# EAGLE design main (EAGLE 6.4)
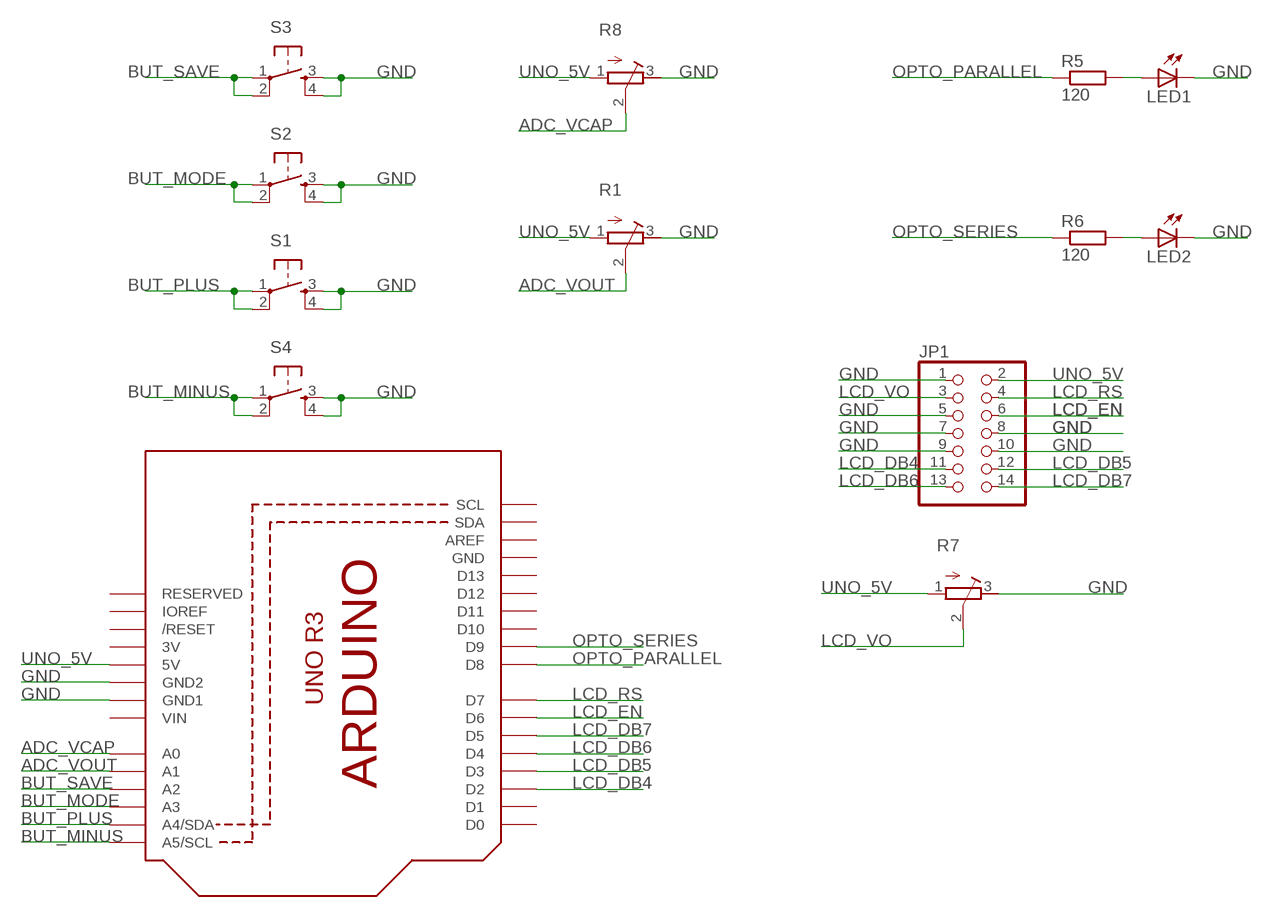
[diagram p0: schematic, sheet 1]

## Parts
JP1  PINHD-2X7  [2X07]
LED1  LED5MM  [LED5MM]
LED2  LED5MM  [LED5MM]
R1  R-TRIMM3339P  [RTRIM3339P]
R5  120  R-EU_0204/5  [0204/5]
R6  120  R-EU_0204/5  [0204/5]
R7  R-TRIMM3339P  [RTRIM3339P]
R8  R-TRIMM3339P  [RTRIM3339P]
S1  TAC_SWITCHPTH  [TACTILE-PTH]
S2  TAC_SWITCHPTH  [TACTILE-PTH]
S3  TAC_SWITCHPTH  [TACTILE-PTH]
S4  TAC_SWITCHPTH  [TACTILE-PTH]
U1  ARDUINOR3-BPLACE  [ARDUINOR3-BPLACE]

## Nets
ADC_VCAP: R8.2(S) U1.A0
ADC_VOUT: R1.2(S) U1.A1
BUT_MINUS: S4.1 S4.2 U1.A5(A5/SCL)
BUT_MODE: S2.1 S2.2 U1.A3
BUT_PLUS: S1.1 S1.2 U1.A4(A4/SDA)
BUT_SAVE: S3.1 S3.2 U1.A2
GND: JP1.1 JP1.5 JP1.7 JP1.8 JP1.9 JP1.10 LED1.K(C) LED2.K(C) R1.3(A) R7.3(A) R8.3(A) S1.3 S1.4 S2.3 S2.4 S3.3 S3.4 S4.3 S4.4 U1.GND1 U1.GND2
LCD_DB4: JP1.11 U1.D2
LCD_DB5: JP1.12 U1.D3
LCD_DB6: JP1.13 U1.D4
LCD_DB7: JP1.14 U1.D5
LCD_EN: JP1.6 U1.D6
LCD_RS: JP1.4 U1.D7
LCD_VO: JP1.3 R7.2(S)
N$3: LED1.A R5.2
N$4: LED2.A R6.2
OPTO_PARALLEL: R5.1 U1.D8
OPTO_SERIES: R6.1 U1.D9
UNO_5V: JP1.2 R1.1(E) R7.1(E) R8.1(E) U1.5V
Unconnected: U1.AREF U1.D0 U1.D1 U1.D10 U1.D11 U1.D12 U1.D13 U1.IOREF U1.RESERVED U1.RESET(/RESET) U1.SCL U1.SDA

## Power pins joined to a net without a drawn wire
3V: U1.3V
GND: U1.GND
VIN: U1.VIN

## Library data of the parts
JP1 = pinhead:PINHD-2X7: PIN HEADER
LED1 LED2 = adafruit:LED: LED OSRAM: - CHIPLED LG R971, LG N971, LY N971, LG Q971, LY Q971, LO R971, LY R971 LH N974, LH R974 LS Q976, LO Q976, LY Q976 LO Q996 - Hyper CHIPLED LW Q18S LB Q993, LB Q99A, LB R99A - SideLED LS A670, LO A670, LY A670, LG A670, LP A670 LB A673, LV A673, LT A673, LW A673 LH A674 LY A675 LS A676, LA A676, LO A676, LY A676, LW A676 LS A679, LY A679, LG A679 - Hyper Micro SIDELED® LS Y876, LA Y876, LO Y876, LY Y876 LT Y87S - SmartLED LW L88C, LW L88S LB L89C, LB L89S, LG L890 LS L89K, LO L89K, LY L89K LS L896, LA L896, LO L896, LY L896 - TOPLED LS T670, LO T670, LY T670, LG T670, LP T670 LSG T670, LSP T670, LSY T670, LOP T670, LYG T670 LG T671, LOG T671, LSG T671 LB T673, LV T673, LT T673, LW T673 LH T674 LS T676, LA T676, LO T676, LY T676, LB T676, LH T676, LSB T676, LW T676 LB T67C, LV T67C, LT T67C, LS T67K, LO T67K, LY T67K, LW E67C LS E67B, LA E67B, LO E67B, LY E67B, LB E67C, LV E67C, LT E67C LW T67C LS T679, LY T679, LG T679 LS T770, LO T770, LY T770, LG T770, LP T770 LB T773, LV T773, LT T773, LW T773 LH T774 LS E675, LA E675, LY E675, LS T675 LS T776, LA T776, LO T776, LY T776, LB T776 LHGB T686 LT T68C, LB T68C - Hyper Mini TOPLED® LB M676 - Mini TOPLED Santana® LG M470 LS M47K, LO M47K, LY M47K Source: http://www.osram.convergy.de/
R1 R7 R8 = resistor:R-TRIMM: Trimm resistor
R5 R6 = rcl:R-EU_: RESISTOR, European symbol
S1-S4 = SparkFun-Electromechanical:TAC_SWITCH: Momentary Switch Button commonly used for reset or general input. Spark Fun Electronics SKU : COM-00097 SMT- SWCH-08247
U1 = adafruit:ARDUINOR3: This is a new object for the new Arduino R3 - with extra pins that you may want to use (such as IOref, and duplicated A4/A5

## Board
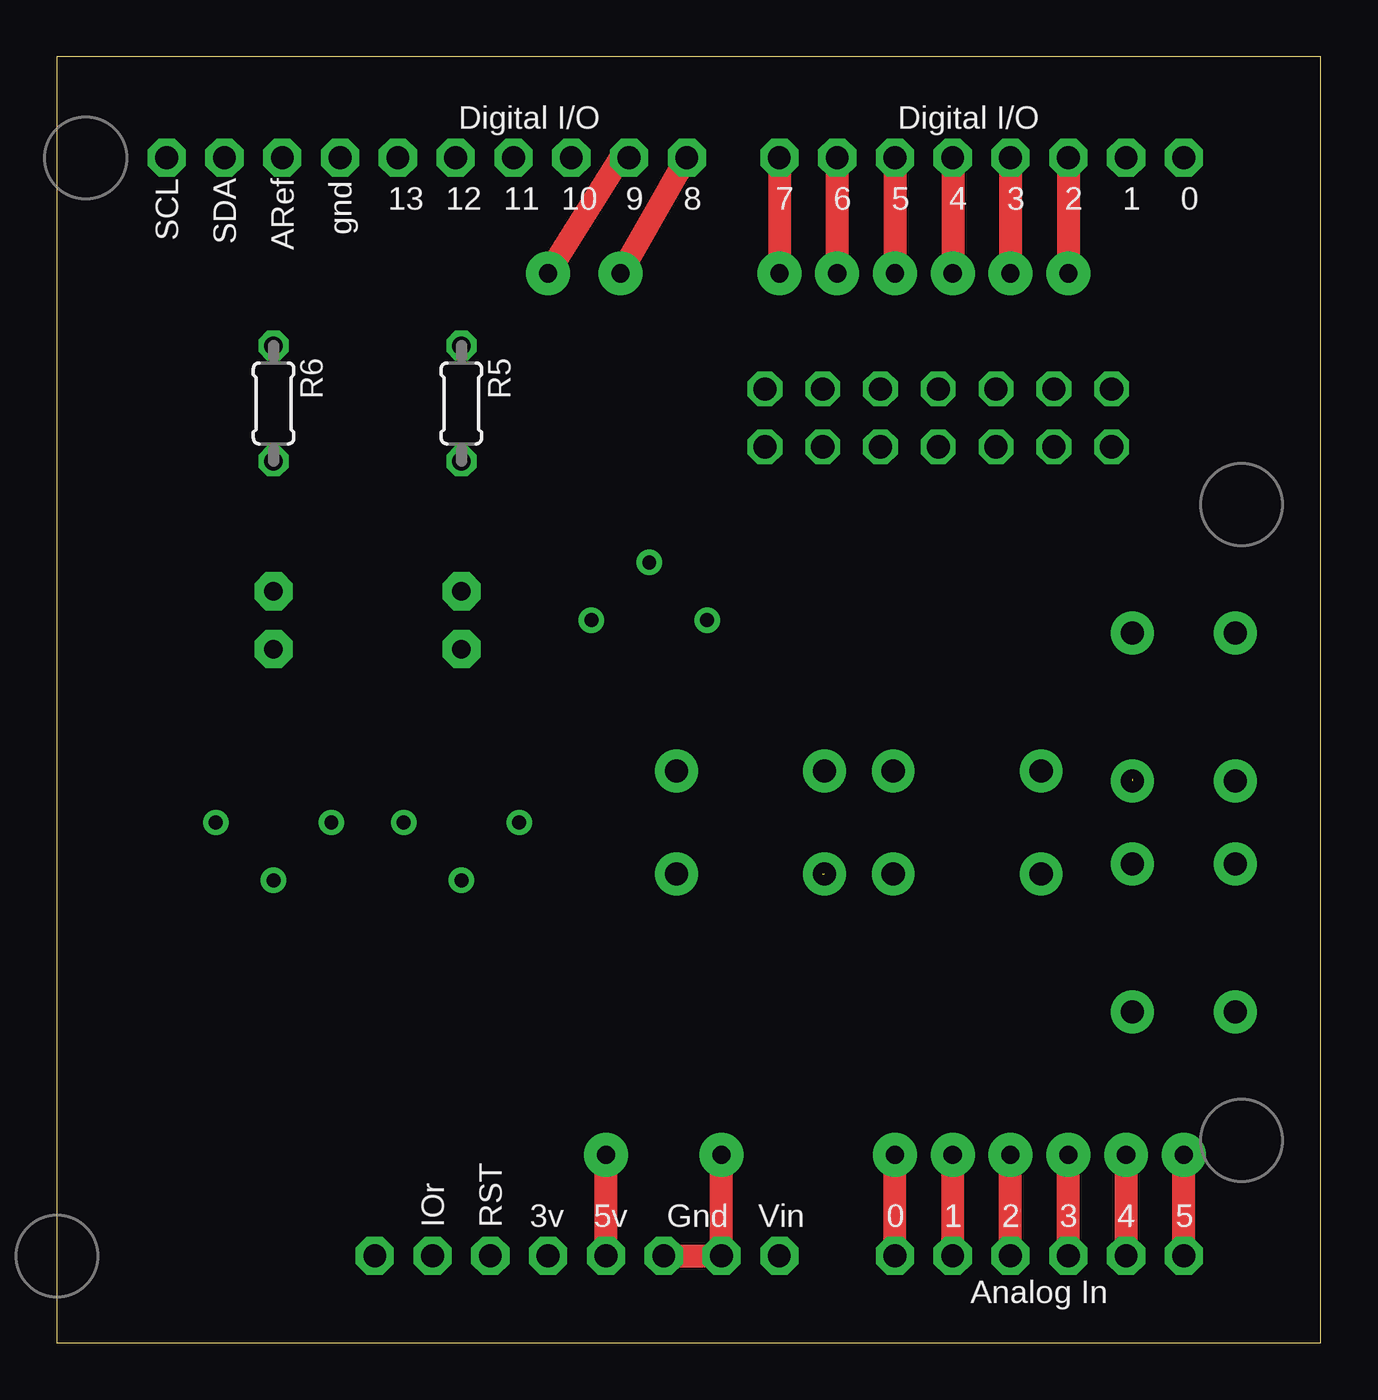
[diagram p1: board, top side]
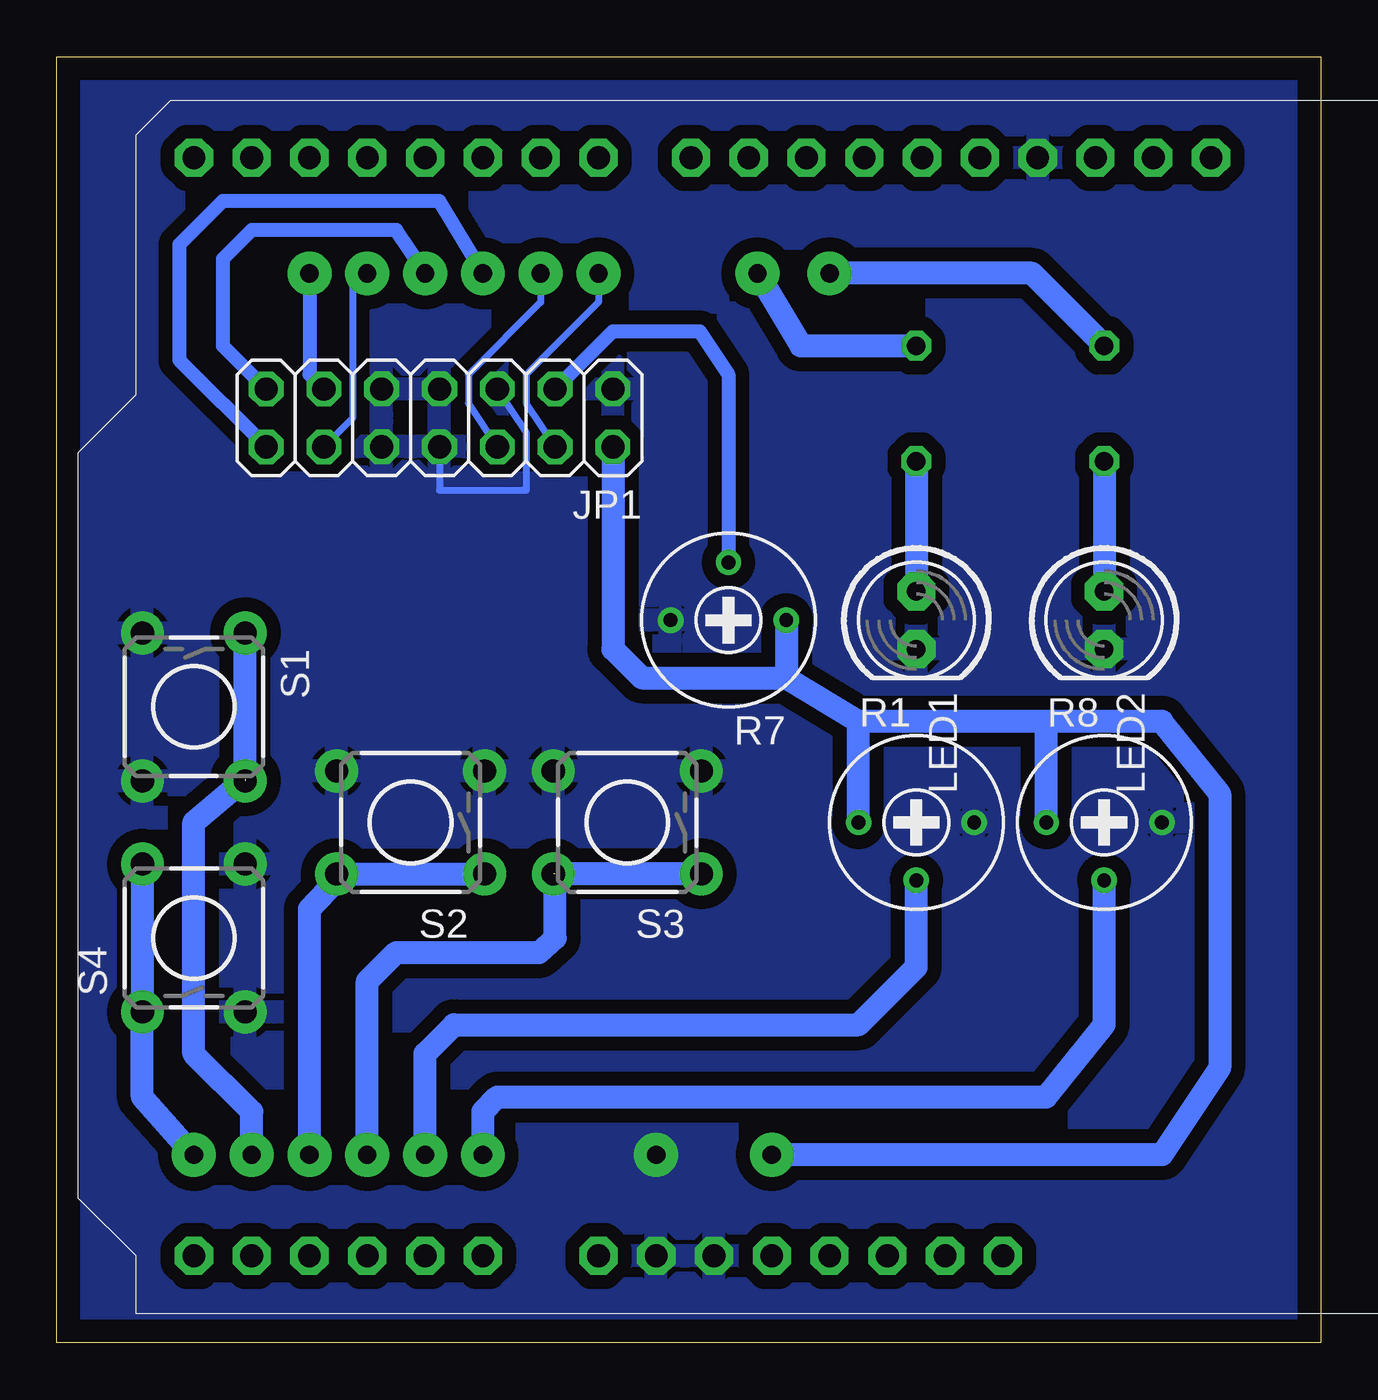
[diagram p2: board, bottom side, seen from below]

Size 55.55 x 56.51 mm. Coordinates in mm from the lower left corner, seen from the top.
Outline: 0,0 55.55,0 55.55,56.51 0,56.51 0,0
Copper layers (1*16): Top 0.035mm / dielectric 1.5mm / Bottom 0.035mm
Design rules "default": minimum track width 10mil, minimum drill 24mil, track to track 8mil, track to pad 8mil, pad to pad 8mil, via to via 8mil, smd to smd 8mil, copper to edge 40mil, drill to drill 8mil, minimum pad ring 10mil, minimum via ring 8mil, stop-mask expansion 4mil, vias tented up to drill 0mil, thermal gap 10mil

### Footprints (pad centres in the part's own frame; a part is rotated, then mirrored left to right if it is on the bottom)
2X07 = drill 1.016 octagon: 1 -7.62,-1.27; 2 -7.62,1.27; 3 -5.08,-1.27; 4 -5.08,1.27; 5 -2.54,-1.27; 6 -2.54,1.27; 7 0,-1.27; 8 0,1.27; 9 2.54,-1.27; 10 2.54,1.27; 11 5.08,-1.27; 12 5.08,1.27; 13 7.62,-1.27; 14 7.62,1.27
LED5MM = drill 0.813 pad 1.676 octagon: A -1.27,0; K 1.27,0
RTRIM3339P = drill 0.61: 1 -2.54,0; 2 0,-2.54; 3 2.54,0
0204/5 = drill 0.813 octagon: 1 -2.54,0; 2 2.54,0
TACTILE-PTH = drill 1.016 pad 1.88: 1 -3.251,2.261; 2 3.251,2.261; 3 -3.251,-2.261; 4 3.251,-2.261
ARDUINOR3-BPLACE = drill 1 pad 1.676 octagon: 3V 35.56,2.54; 5V 38.1,2.54; A0 50.8,2.54; A1 53.34,2.54; A2 55.88,2.54; A3 58.42,2.54; A4 60.96,2.54; A5 63.5,2.54; AREF 23.876,50.8; D0 63.5,50.8; D1 60.96,50.8; D2 58.42,50.8; D3 55.88,50.8; D4 53.34,50.8; D5 50.8,50.8; D6 48.26,50.8; D7 45.72,50.8; D8 41.656,50.8; D9 39.116,50.8; D10 36.576,50.8; D11 34.036,50.8; D12 31.496,50.8; D13 28.956,50.8; GND 26.416,50.8; GND1 43.18,2.54; GND2 40.64,2.54; IOREF 30.48,2.54; RESERVED 27.94,2.54; RESET 33.02,2.54; SCL 18.796,50.8; SDA 21.336,50.8; VIN 45.72,2.54

### Placement (x,y rotation side)
JP1  38.73,40.64 180 bottom
LED1  17.78,31.75 270 bottom
LED2  9.53,31.75 270 bottom
R1  17.78,22.86 0 bottom
R5  17.78,41.27 270 top
R6  9.53,41.27 270 top
R7  26.04,31.75 180 bottom
R8  9.53,22.86 0 bottom
S1  49.53,27.94 270 bottom
S2  40.01,22.86 180 bottom
S3  30.48,22.86 180 bottom
S4  49.53,17.78 90 bottom
U1  -13.97,1.27 0 top

### Tracks (layer width: path | path; a pad name or v marks a point on that pad's centre or on a via)
ADC_VCAP  (via drill 0.8 pad 1.93)
  Top 1.016: U1.A0 v36.83,8.26
  Bottom 1.016: v36.83,8.26 36.83,10.16 36.2,10.79 12.06,10.79 9.53,13.97 R8.2
ADC_VOUT  (via drill 0.8 pad 1.93)
  Top 1.016: U1.A1 v39.37,8.26
  Bottom 1.016: v39.37,8.26 39.37,12.7 38.1,13.97 20.32,13.97 17.78,16.51 R1.2
BUT_MINUS  (via drill 0.8 pad 1.93)
  Top 1.016: U1.A5 v49.53,8.26
  Bottom 1.016: S4.2 S4.1 51.79,10.79 v49.53,8.26
BUT_MODE  (via drill 0.8 pad 1.93)
  Top 1.016: U1.A3 v44.45,8.26
  Bottom 1.016: S2.1 S2.2 43.26,20.32 44.45,19.05 v44.45,8.26
BUT_PLUS  (via drill 0.8 pad 1.93)  (1 unrouted)
  Top 1.016: U1.A4 v46.99,8.26
  Bottom 1.016: v46.99,8.26 46.99,10.16 49.53,12.7 49.53,22.86 47.27,24.77 S1.1
BUT_SAVE  (via drill 0.8 pad 1.93)  (1 unrouted)
  Top 1.016: U1.A2 v41.91,8.26
  Bottom 1.016: v41.91,8.26 41.91,15.88 40.64,17.14 34.37,17.14 33.66,17.78 33.66,20.6 | S3.1 S3.2
GND  (via drill 0.8 pad 1.93)
  Top 1.016: U1.GND2 U1.GND1 v29.21,8.26
  Bottom 0.305: JP1.5 34.92,40.01 34.92,37.47 38.73,37.47 JP1.8
  pour Bottom (isolate 0.61): -0.64,56.52 55.88,56.52 56.52,0 0,0
LCD_DB4  (via drill 0.8 pad 1.93)
  Top 1.016: U1.D2 v44.45,46.99
  Bottom 0.61: v44.45,46.99 44.45,42.55 JP1.11
LCD_DB5  (via drill 0.8 pad 1.93)
  Top 1.016: U1.D3 v41.91,46.99
  Bottom 0.305: v41.91,46.99 42.55,46.35 42.55,40.64 JP1.12
LCD_DB6  (via drill 0.8 pad 1.93)
  Top 1.016: U1.D4 v39.37,46.99
  Bottom 0.61: v39.37,46.99 40.64,48.9 46.99,48.9 48.26,47.62 48.26,43.81 JP1.13
LCD_DB7  (via drill 0.8 pad 1.93)
  Top 1.016: U1.D5 v36.83,46.99
  Bottom 0.61: v36.83,46.99 38.73,50.16 48.26,50.16 50.16,48.26 50.16,43.18 JP1.14
LCD_EN  (via drill 0.8 pad 1.93)
  Top 1.016: U1.D6 v34.29,46.99
  Bottom 0.305: v34.29,46.99 34.29,45.72 37.47,42.55 37.47,41.27 JP1.6
LCD_RS  (via drill 0.8 pad 1.93)
  Top 1.016: U1.D7 v31.75,46.99
  Bottom 0.305: v31.75,46.99 31.75,45.72 34.92,42.55 34.92,41.27 JP1.4
LCD_VO
  Bottom 0.61: JP1.3 31.11,44.45 27.3,44.45 26.04,42.55 R7.2
N$3
  Bottom 1.016: R5.2 LED1.A
N$4
  Bottom 1.016: R6.2 LED2.A
OPTO_PARALLEL  (via drill 0.8 pad 1.93)
  Top 1.016: U1.D8 27.3,51.44 v24.77,46.99
  Bottom 1.016: v24.77,46.99 22.86,43.81 R5.1
OPTO_SERIES  (via drill 0.8 pad 1.93)
  Top 1.016: U1.D9 24.77,52.07 v21.59,46.99
  Bottom 1.016: R6.1 12.7,46.99 v21.59,46.99
UNO_5V  (via drill 0.8 pad 1.93)
  Top 1.016: U1.5V v24.13,8.26
  Bottom 1.016: R7.1 23.5,29.21 | 23.5,29.21 20.32,27.3 | JP1.2 31.11,30.48 29.84,29.21 23.5,29.21 | 12.06,27.3 6.99,27.3 4.45,24.13 4.45,12.06 6.99,8.26 v24.13,8.26 | 12.06,27.3 20.32,27.3 | R8.1 12.06,27.3 | R1.1 20.32,27.3